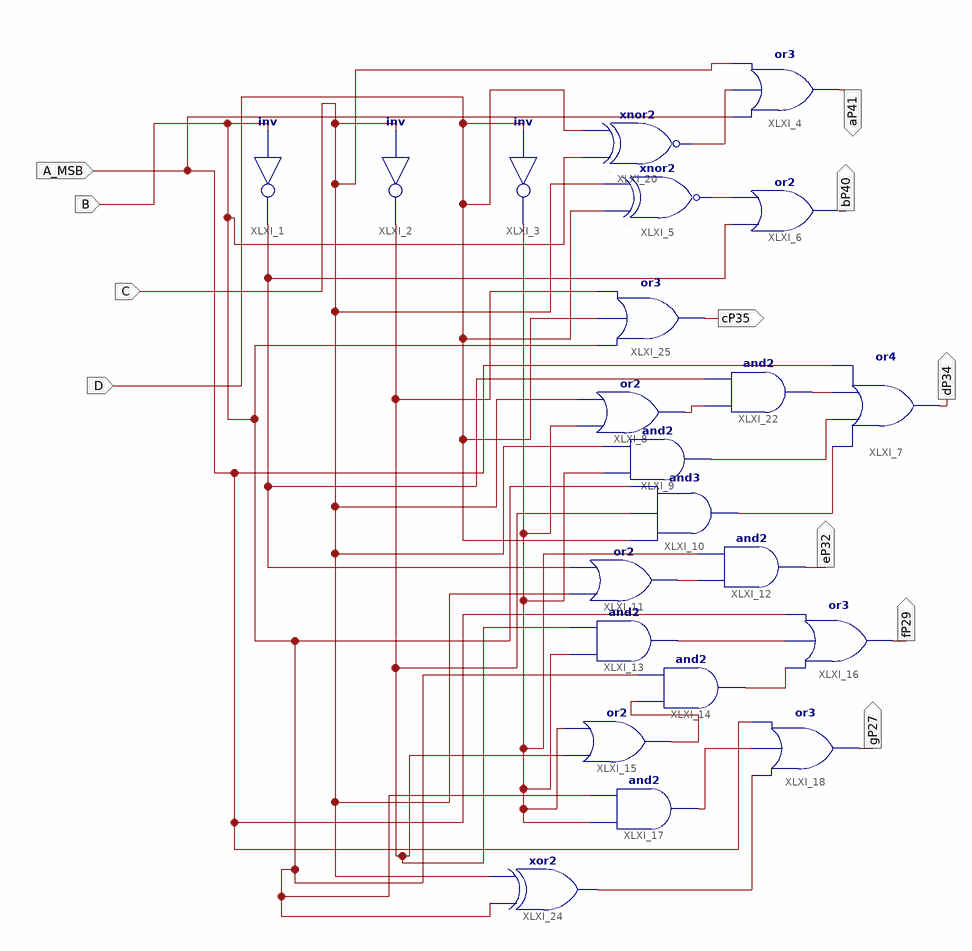
[diagram p0: schematic sheet 1]
// Xilinx ISE schematic BCD7Seg.sch (spartan6) as structural Verilog: 22 symbols, 11 ports
module BCD7Seg (
  input  A_MSB,
  input  B,
  input  C,
  input  D,
  output aP41,
  output bP40,
  output cP35,
  output dP34,
  output eP32,
  output fP29,
  output gP27
);

  wire XLXN_2, XLXN_4, XLXN_7, XLXN_10, XLXN_14, XLXN_15, XLXN_18, XLXN_19, XLXN_23, XLXN_24, XLXN_26,
       XLXN_27, XLXN_32, XLXN_279, XLXN_286;

  not XLXI_1 (XLXN_32, B);
  not XLXI_2 (XLXN_279, C);
  not XLXI_3 (XLXN_18, D);
  or XLXI_4 (aP41, A_MSB, XLXN_2, C);
  xnor XLXI_5 (XLXN_4, D, C);
  or XLXI_6 (bP40, XLXN_32, XLXN_4);
  or XLXI_7 (dP34, XLXN_7, XLXN_10, XLXN_14, A_MSB);
  or XLXI_8 (XLXN_286, XLXN_18, C);
  and XLXI_9 (XLXN_10, XLXN_18, C);
  and XLXI_10 (XLXN_7, D, XLXN_279, B);
  or XLXI_11 (XLXN_15, C, XLXN_32);
  and XLXI_12 (eP32, XLXN_15, XLXN_18);
  and XLXI_13 (XLXN_23, XLXN_18, XLXN_279);
  and XLXI_14 (XLXN_24, XLXN_19, B);
  or XLXI_15 (XLXN_19, XLXN_279, XLXN_18);
  or XLXI_16 (fP29, XLXN_24, XLXN_23, A_MSB);
  and XLXI_17 (XLXN_26, XLXN_18, B);
  or XLXI_18 (gP27, XLXN_27, XLXN_26, A_MSB);
  xor XLXI_24 (XLXN_27, B, C);
  xnor XLXI_20 (XLXN_2, B, D);
  or XLXI_25 (cP35, B, D, XLXN_279);
  and XLXI_22 (XLXN_14, XLXN_286, XLXN_32);
endmodule
